# Altium project ASK RF Transmitter Module V1.0.PrjPCB
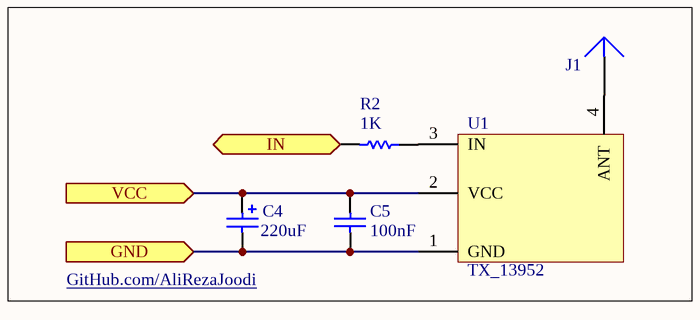
[diagram p0: RF Module_ASK_Transfer.SchDoc]
1 sheet, 5 parts. Net scope: flat (ports and power ports of the same name join across sheets).
Board file: Main.PcbDoc

## Sheet RF Module_ASK_Transfer.SchDoc
size 88 x 38 mm

### Parts
C4  220uF  [CAPPR3.05-3.81x6.35]
C5  100nF  [CAPNTO2.54-3.05x1.78A]
J1  COAX-M  [PIN1]  (value not drawn)
R2  1K  [AXIAL-0.4]
U1  TX_13952  [RF_ASK_TX_13952]

### Ports
GND (in), IN (in), VCC (in)

### Nets
NetC4_1: C4.1 C5.2 U1.2(VCC) ; port VCC
NetC4_2: C4.2 C5.1 U1.1(GND) ; port GND
NetJ1_1: J1.1(A) U1.4(ANT)
NetR2_1: R2.1 U1.3(IN)
NetR2_2: R2.2 ; port IN

### Notes on the sheet
- (near C4) GitHub.com/AliRezaJoodi

### Library data of the parts
C4 = Cap Pol1: Polarized Capacitor (Radial); Manufacturer: Generic Components; Class I: Passive; Published: 8-Jun-2000; Revision: July-2002: Re-released for DXP Platform.; Publisher: Altium Limited; Class II: Capacitor
C5 = Cap: Capacitor; Manufacturer: Generic Components; Class I: Passive; Published: 8-Jun-2000; Revision: July-2002: Re-released for DXP Platform.; Publisher: Altium Limited; Class II: Capacitor
J1 = COAX-M: Coax-M Connector; Manufacturer: Generic Components; Revision: July-2002: Re-released for DXP Platform.; Publisher: Altium Limited; Class I: Connector
R2 = Res1: Resistor; Published: 8-Jun-2000; LatestRevisionDate: 17-Jul-2002; LatestRevisionNote: Re-released for DXP Platform.; PackageReference: AXIAL-0.3; Publisher: Altium Limited
U1 = RF_ASK_TX_13952_2: Voltage Regulator; Manufacturer: Generic Components; Class I: Power Management; Published: 24-Mar-1999; Revision: July-2002: Re-released for DXP Platform.; Publisher: Altium Limited; Class II: Voltage Regulator